# Altium schematic sheet SHDN-BSPD-S03-V00-BSPDWindowComparitor.SchDoc: Window Comparitor
size A3; DrawnBy: Jonn Dillon; DocumentNumber: 3; Revision: 01; SheetNumber: 3; SheetTotal: 10
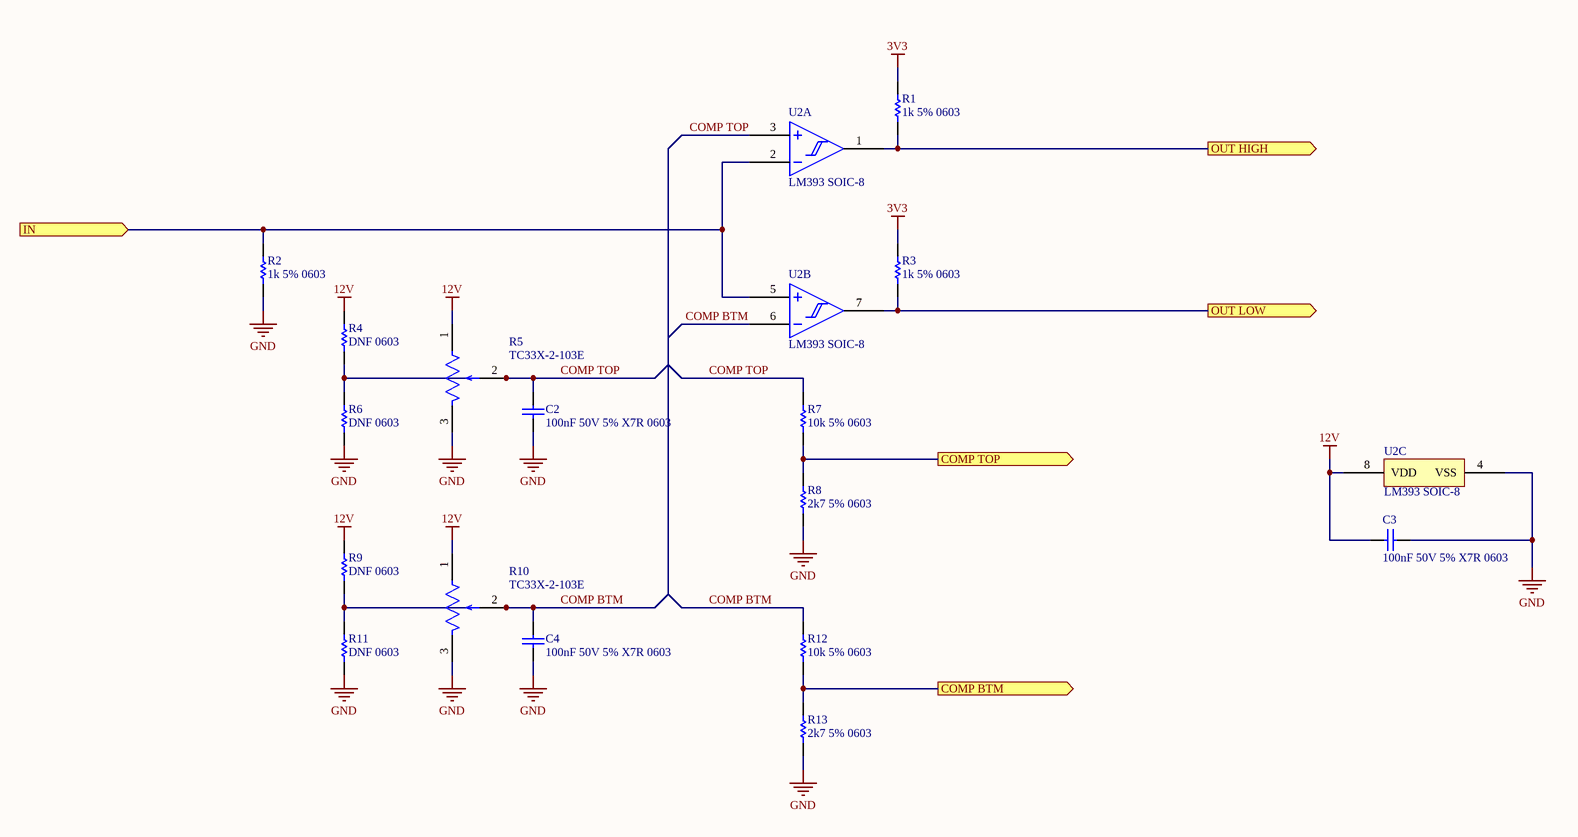
[diagram p0: SHDN-BSPD-S03-V00-BSPDWindowComparitor.SchDoc]

## Parts
C2  100nF 50V 5% X7R 0603  [Cap_Ceramic_0603]
C3  100nF 50V 5% X7R 0603  [Cap_Ceramic_0603]
C4  100nF 50V 5% X7R 0603  [Cap_Ceramic_0603]
R1  1k 5% 0603  [Res_ThinFilm_0603]
R2  1k 5% 0603  [Res_ThinFilm_0603]
R3  1k 5% 0603  [Res_ThinFilm_0603]
R4  DNF 0603  [Res_ThinFilm_0603]
R5  TC33X-2-103E  [TC33]
R6  DNF 0603  [Res_ThinFilm_0603]
R7  10k 5% 0603  [Res_ThinFilm_0603]
R8  2k7 5% 0603  [Res_ThinFilm_0603]
R9  DNF 0603  [Res_ThinFilm_0603]
R10  TC33X-2-103E  [TC33]
R11  DNF 0603  [Res_ThinFilm_0603]
R12  10k 5% 0603  [Res_ThinFilm_0603]
R13  2k7 5% 0603  [Res_ThinFilm_0603]
U2  LM393 SOIC-8  [SOIC-8]  (parts A,B,C of 3)

## Ports
COMP BTM (out), COMP TOP (out), IN (in), OUT HIGH (out), OUT LOW (out)

## Nets
3V3: R1.2 R3.2
12V: C3.1 R4.2 R5.1 R9.2 R10.1 U2.8(VDD)
GND: C2.1 C3.2 C4.1 R2.1 R5.3 R6.1 R8.1 R10.3 R11.1 R13.1 U2.4(VSS)
COMP BTM: C4.2 R9.1 R10.2 R11.2 R12.1 U2.6(IN2-)
COMP BTM: R12.2 R13.2 ; port COMP BTM  [a separate net that carries the same name]
COMP TOP: C2.2 R4.1 R5.2 R6.2 R7.1 U2.3(IN1+)
COMP TOP: R7.2 R8.2 ; port COMP TOP  [a separate net that carries the same name]
IN: R2.2 U2.2(IN1-) U2.5(IN2+) ; port IN
OUT HIGH: R1.1 U2.1(OUT1) ; port OUT HIGH
OUT LOW: R3.1 U2.7(OUT1) ; port OUT LOW

## Notes on the sheet
- Revision History:
- Sheet Title:
- Rev
- Date
- Description
- Project:
- Size:
- Drawn By:
- A3
- Number:
- Revision:
- Sheet
- Version:
- of
- QUT Motorsport
- O-120, Gardens Point
- 2 George Street
- Brisbane, QLD 4000
- Australia
- Print Date:
- Print Time:
- File Name:

## Library data of the parts
C2-C4 = 100nF 50V 5% X7R 0603: Capacitor, Ceramic, SMD, 100nF, 50V, 5%, X7R, 0603
R1-R3 = 1k 5% 0603: Resistor, SMD, 1k, 0.1W, 5%, 0603
R4 R6 R9 R11 = DNF 0603: Resistor, SMD, DNF, 0.1W, 0603
R5 R10 = TC33X-2-103E: 10 kOhms 0.1W, 1/10W J Lead Surface Mount Trimmer Potentiometer Cermet 1 Turn Top Adjustment
R7 R12 = 10k 5% 0603: Resistor, SMD, 10k, 0.1W, 5%, 0603
R8 R13 = 2k7 5% 0603: Resistor, SMD, 2k7, 0.1W, 5%, 0603
U2 = LM393: General Purpose Comparitor 2 Circuit 8-SOIC